# Altium schematic sheet [03]-IMU.SchDoc: ENTER SHEET TITLE
size B; Engineer: ENTER ENGINEER NAME; Organization: CUAir; Address1: L3, 12a Rodborough Rd; Address2: Frenchs Forest; Address3: NSW; Address4: Australia 2086; Revision: ENTER REVISION NUMBER; CompetitionYear: 2019; CPN: ENTER CPN; PROJECT: ENTER PROJECT NAME
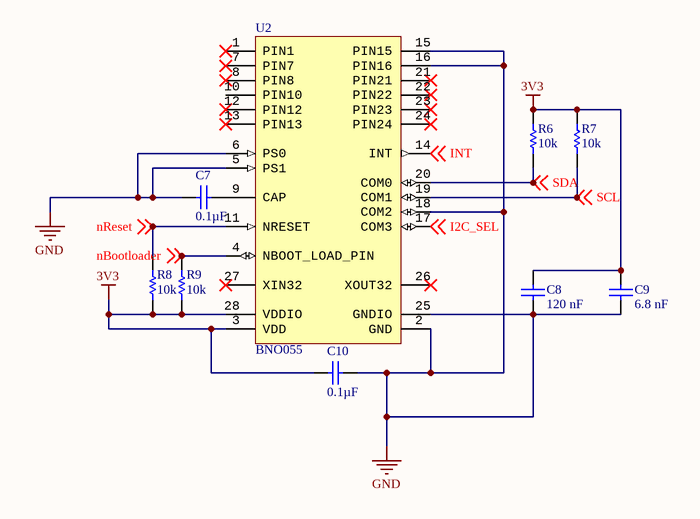
[diagram p0: [03]-IMU.SchDoc]

## Parts
C7  Capacitance: 0.1µF  [CAPC2013X145X20ML20]  (hidden comment: C2012X7R2A104K125AA)
C8  value 120 nF  [CAPC1005X55X25ML05T10]  (hidden comment: GRM155R71H123KA12D)
C9  value 6.8 nF  [CAPC0603X33X15NL03T05]  (hidden comment: GRM033R71A682KA01D)
C10  Capacitance: 0.1µF  [CAPC2013X145X20ML20]  (hidden comment: C2012X7R2A104K125AA)
R6  Resistance: 10k  [RESC2013X60X35ML10T20]  (hidden comment: RC0805JR-0710KL)
R7  Resistance: 10k  [RESC2013X60X35ML10T20]  (hidden comment: RC0805JR-0710KL)
R8  Resistance: 10k  [RESC2013X60X35ML10T20]  (hidden comment: RC0805JR-0710KL)
R9  Resistance: 10k  [RESC2013X60X35ML10T20]  (hidden comment: RC0805JR-0710KL)
U2  BNO055  [BOSC-LGA-28_M]

## Nets
3V3: C8.2 C9.2 C10.2 R6.2 R7.2 R8.1 R9.1 U2.3(VDD) U2.28(VDDIO)
GND: C7.2 C8.1 C9.1 C10.1 U2.2(GND) U2.5(PS1) U2.6(PS0) U2.15(PIN15) U2.16(PIN16) U2.18(COM2) U2.25(GNDIO)
I2C_SEL: U2.17(COM3) ; off-sheet I2C_SEL
INT: U2.14(INT) ; off-sheet INT
nBootloader: R9.2 U2.4(NBOOT_LOAD_PIN) ; off-sheet nBootloader
nReset: R8.2 U2.11(NRESET) ; off-sheet nReset
SCL: R7.1 U2.19(COM1) ; off-sheet SCL
SDA: R6.1 U2.20(COM0) ; off-sheet SDA
NetC7_1: C7.1 U2.9(CAP)

Not connected (* = marked no-connect by the designer): U2 1(PIN1)* 7(PIN7)* 8(PIN8)* 10(PIN10) 12(PIN12)* 13(PIN13)* 21(PIN21)* 22(PIN22)* 23(PIN23)* 24(PIN24)* 26(XOUT32)* 27(XIN32)*

## Notes on the sheet
- Project
- Title
- Size:
- Date:
- B
- Number:
- Revision:
- File:

## Library data of the parts
C7 C10 = CMP-2000-05453-1: Chip Capacitor, 100 nF, +/- 10%, 100 V, -55 to 1255 degC, 0805 (2012 Metric), RoHS, Tape and Reel; Manufacturer: TDK; PCN Part Number: MLCCPartNumberChange30/Nov/2012; Temperature Coefficient: X7R; Voltage - Rated: 100V; Kits: SAMPLEKIT1008-ND-KITCAPCERMLCC100V-630V; Other Names: 445-1418-1; Online Catalog: CSeries,MidVoltage; Featured Product: C-SeriesMidVoltageMLCCs; Catalog Drawings: CSERIES_2012-0805_1.45; Product Training Modules: HighCapacitanceReplacementSEAT,CCV,andTVCLDesignToolsGuidetoReplacinganElectrolyticCapacitorwithanMLCC; Applications: GeneralPurpose; Datasheet Version: Jul-13; Mounting Type: SurfaceMount,MLCC; Height - Seated (Max): -; Packaging: CutTape(CT); Datasheet URL: https://datasheet.ciiva.com/11788/0900766b80fc5cba-11788142.pdf; Tolerance: ±10%; Package Reference: 805; Manufacturer URL: http://www.tdk.com/; Thickness (Max): 0.057"(1.45mm); Series: C; Lead Style: -; Operating Temperature: -55degC~125degC; Category: Capacitors; Package Description: 2-Pin Surface Mount Device, Body 2 x 1.25 mm; Standard Package: 1; Package / Case: 0805(2012Metric); Family: CeramicCapacitors; RoHS Information: RoHSCertificate-MLCC; Size / Dimension: 0.079"Lx0.049"W(2.00mmx1.25mm); Lead Spacing: -; Ratings: -; Features: -
C8 = CMP-2008-03957-1: 120 nF Capacitor; Manufacturer: Murata; Part Number: GRM155R71H123KA12D
C9 = CMP-2010-01688-1: Manufacturer: Murata; Part Number: GRM033R71A682KA01D
R6-R9 = CMP-2000-05025-1: Chip Resistor, 10 KOhm, +/- 5%, 0.125 W, -55 to 155 degC, 0805 (2012 Metric), RoHS, Tape and Reel; Manufacturer: Yageo; Resistor Element Type: ThickFilm; Voltage Rating: 150V; Product Range: RCSeries; SVHC: ToBeAdvised; Resistor Case Style: 0805[2012Metric]; Temperature Coefficient: ±100ppm/degC; Power Rating: 250mW; Automotive Qualification Standard: -; Datasheet Version: REV. 2, 09/2004; Packaging: CutTape; Resistance Tolerance: ±5%; MSL: MSL1-Unlimited; Manufacturer URL: http://www.yageo.com/; Datasheet URL: http://www.yageo.ru/pdf/RC0805.pdf; Package Description: 2-Pin Surface Mounted Device, Body 2 x 1.25 mm; Package Reference: 805
U2 = CMP-2000-05075-1: Intelligent 9-Axis Absolute Orientation Sensor, 1.7 V to 3.6 V, -40 to 85 degC, 28-Pin LGA, RoHS, Tape and Reel; Manufacturer: Bosch Sensortec; Manufacturer URL: http://www.bosch-sensortec.com; Datasheet URL: http://datasheet.octopart.com/BNO055-Bosch-datasheet-45840915.pdf; Datasheet Version: Rev. 1.3, 08/2015